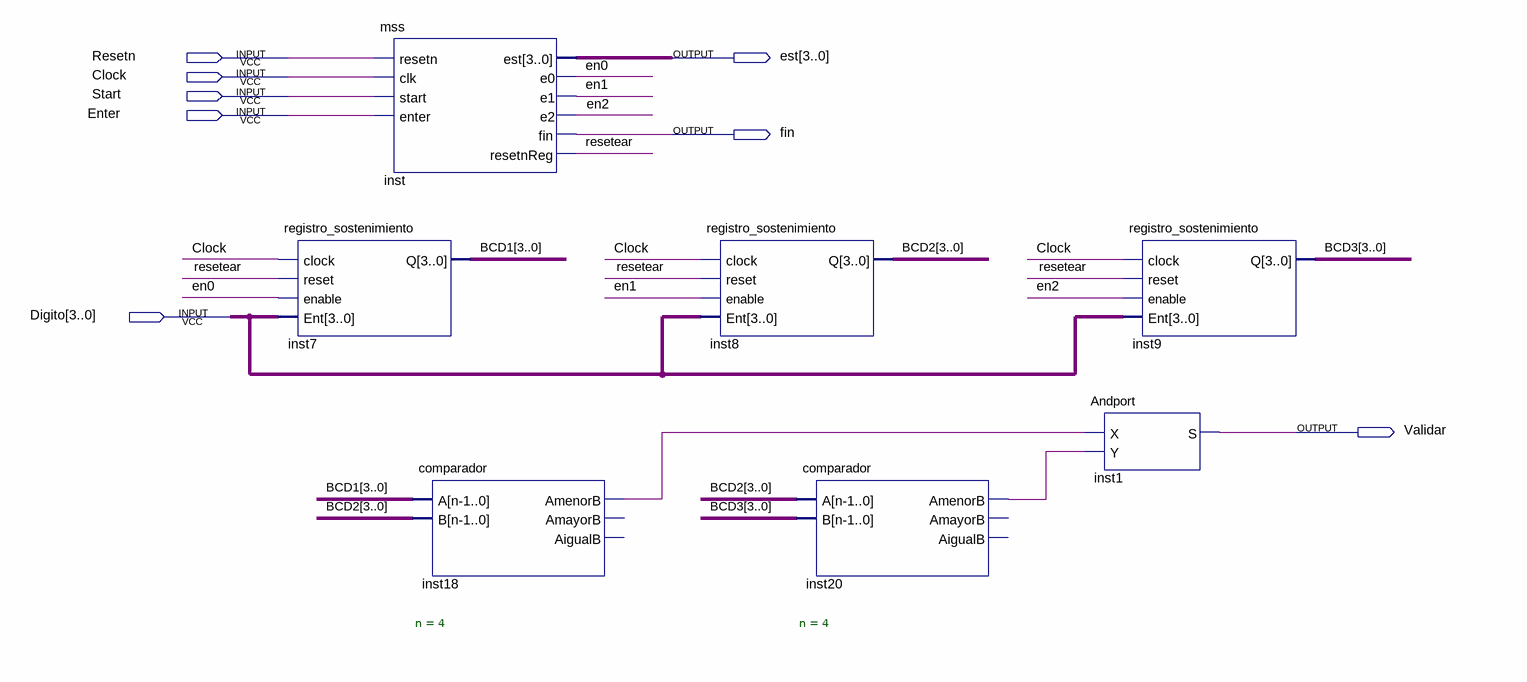
[diagram p0: schematic sheet]
// Quartus schematic BCDascendente.bdf as structural Verilog: 7 symbols, 8 pins
module BCDascendente (
  input  Resetn,
  input  Clock,
  input  Start,
  input  Enter,
  input  [3:0] Digito,
  output [3:0] est,
  output fin,
  output Validar
);

  wire en0, en1, en2, inst18_amenorb, inst20_amenorb, resetear;
  wire [3:0] BCD1, BCD2, BCD3;

  registro_sostenimiento inst7 (.clock(Clock), .reset(resetear), .enable(en0), .Ent(Digito), .Q(BCD1));
  mss inst (
    .resetn(Resetn), .clk(Clock), .start(Start), .enter(Enter), .est(est), .e0(en0), .e1(en1), .e2(en2),
    .fin(fin), .resetnReg(resetear));
  comparador #(.n(4)) inst18 (.A(BCD1), .B(BCD2), .AmenorB(inst18_amenorb));  // open: AmayorB, AigualB
  registro_sostenimiento inst8 (.clock(Clock), .reset(resetear), .enable(en1), .Ent(Digito), .Q(BCD2));
  comparador #(.n(4)) inst20 (.A(BCD2), .B(BCD3), .AmenorB(inst20_amenorb));  // open: AmayorB, AigualB
  registro_sostenimiento inst9 (.clock(Clock), .reset(resetear), .enable(en2), .Ent(Digito), .Q(BCD3));
  Andport inst1 (.X(inst18_amenorb), .Y(inst20_amenorb), .S(Validar));
endmodule
